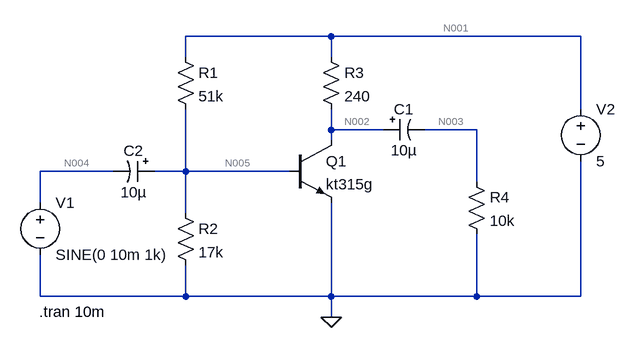
[diagram p0: schematic 41 Підсилювач.asc]
41 Підсилювач.asc, the LTspice schematic file:
Version 4
SHEET 1 880 680
WIRE 352 -64 128 -64
WIRE 736 -64 352 -64
WIRE 128 -32 128 -64
WIRE 352 -32 352 -64
WIRE 736 48 736 -64
WIRE 352 80 352 48
WIRE 432 80 352 80
WIRE 576 80 496 80
WIRE 352 96 352 80
WIRE 16 144 -96 144
WIRE 128 144 128 48
WIRE 128 144 80 144
WIRE 288 144 128 144
WIRE 576 160 576 80
WIRE -96 192 -96 144
WIRE 128 208 128 144
WIRE -96 336 -96 272
WIRE 128 336 128 288
WIRE 128 336 -96 336
WIRE 352 336 352 192
WIRE 352 336 128 336
WIRE 576 336 576 240
WIRE 576 336 352 336
WIRE 736 336 736 128
WIRE 736 336 576 336
WIRE 352 368 352 336
FLAG 352 368 0
SYMBOL res 112 -48 R0
SYMATTR InstName R1
SYMATTR Value 51k
SYMBOL res 112 192 R0
SYMATTR InstName R2
SYMATTR Value 17k
SYMBOL res 336 -48 R0
SYMATTR InstName R3
SYMATTR Value 240
SYMBOL res 560 144 R0
SYMATTR InstName R4
SYMATTR Value 10k
SYMBOL npn 288 96 R0
SYMATTR InstName Q1
SYMATTR Value kt315g
SYMBOL polcap 432 64 M90
WINDOW 0 0 32 VBottom 2
WINDOW 3 32 32 VTop 2
SYMATTR InstName C1
SYMATTR Value 10µ
SYMATTR Description Capacitor
SYMATTR Type cap
SYMATTR SpiceLine V=16 Irms=0 Rser=11 Lser=0
SYMBOL polcap 80 128 R90
WINDOW 0 0 32 VBottom 2
WINDOW 3 32 32 VTop 2
SYMATTR InstName C2
SYMATTR Value 10µ
SYMATTR Description Capacitor
SYMATTR Type cap
SYMATTR SpiceLine V=16 Irms=0 Rser=11 Lser=0
SYMBOL voltage -96 176 R0
WINDOW 123 0 0 Left 2
WINDOW 39 0 0 Left 2
SYMATTR InstName V1
SYMATTR Value SINE(0 10m 1k)
SYMBOL voltage 736 32 R0
WINDOW 123 0 0 Left 2
WINDOW 39 0 0 Left 2
SYMATTR InstName V2
SYMATTR Value 5
TEXT -98 360 Left 2 !.tran 10m

The netlist it stands for:
* 41 Підсилювач.asc
R1 N001 N005 51k
R2 N005 0 17k
R3 N001 N002 240
R4 N003 0 10k
Q1 N002 N005 0 0 kt315g
C1 N002 N003 10µ V=16 Irms=0 Rser=11 Lser=0
C2 N005 N004 10µ V=16 Irms=0 Rser=11 Lser=0
V1 N004 0 SINE(0 10m 1k)
V2 N001 0 5
.model NPN NPN
.model PNP PNP
.lib standard.bjt
.tran 10m
.backanno
.end

* Results of the author's LTspice run, read from the files saved beside the schematic
* Operating Point, zero values left out:
*   V(n001) = 5 V
*   V(n005) = 806.5 mV
*   V(n002) = 4.165 V
*   Ic(Q1) = 3.479 mA
*   Ib(Q1) = 34.79 µA
*   Ie(Q1) = -3.513 mA
*   I(R3) = 3.479 mA
*   I(R2) = 47.44 µA
*   I(R1) = 82.23 µA
*   I(V2) = -3.561 mA
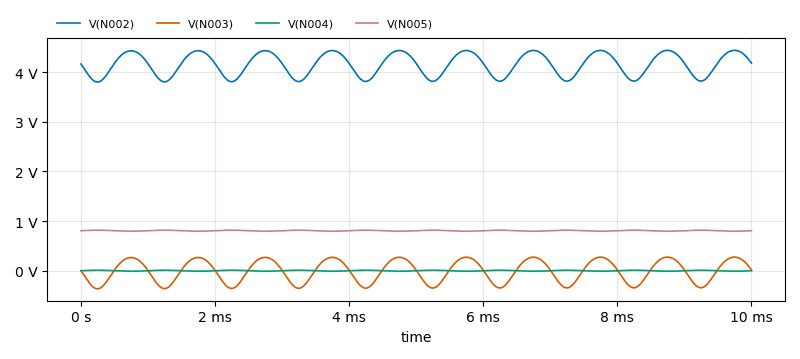
[diagram p1: Transient Analysis of 41 Підсилювач.asc, plotted from the saved traces]
* Transient Analysis, 1 run:
*   V(N002): min 3.8 V, max 4.438 V, average 4.153 V, rms 4.158 V, last 4.18 V
*   V(N003): min -363.7 mV, max 274.6 mV, average -11.42 mV, rms 220.1 mV, last 16.39 mV
*   V(N004): min -9.99 mV, max 9.99 mV, average -1.042 µV, rms 7.064 mV, last 0 V
*   V(N005): min 795.9 mV, max 816 mV, average 805.9 mV, rms 806 mV, last 806 mV